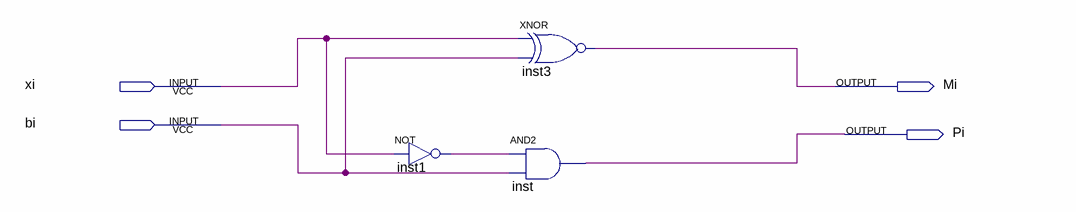
[diagram p0: schematic sheet]
// Quartus schematic MenorIgual1bit.bdf as structural Verilog: 3 symbols, 4 pins
module MenorIgual1bit (
  input  xi,
  input  bi,
  output Mi,
  output Pi
);

  wire inst1_out;

  not inst1 (inst1_out, xi);
  xnor inst3 (Mi, xi, bi);
  and inst (Pi, inst1_out, bi);
endmodule
